# Altium schematic sheet rtc_accel.SchDoc: Opo8001
size Letter; Author: William W. Huang; Organization: Altium Limited; Address1: L3, 12a Rodborough Rd; Address2: Frenchs Forest; Address3: NSW; Address4: Australia 2086; Revision: 2
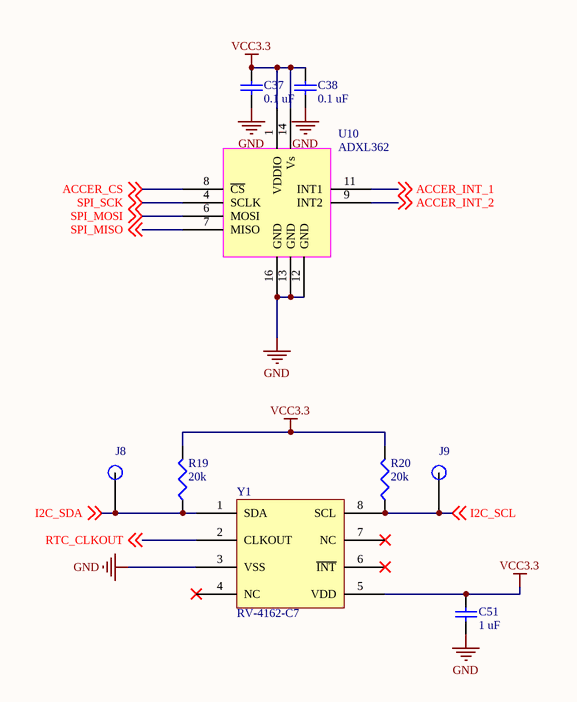
[diagram p0: rtc_accel.SchDoc]

## Parts
C37  value 0.1 uF  [0402]  (hidden comment: Ceramic capacitor)
C38  value 0.1 uF  [0402]  (hidden comment: Ceramic capacitor)
C51  value 1 uF  [0402]  (hidden comment: Ceramic capacitor)
J8  RCU 0603 SMD Testpoint  [RCU_0603]  (value not drawn)
J9  RCU 0603 SMD Testpoint  [RCU_0603]  (value not drawn)
R19  value 20k  [0402]  (hidden comment: 20k Resistor)
R20  value 20k  [0402]  (hidden comment: 20k Resistor)
U10  ADXL362  [LGA_CC-16-4]
Y1  RV-4162-C7  [RV4162]

## Nets
GND: C37.2 C38.2 C51.2 U10.12(GND) U10.13(GND) U10.16(GND) Y1.3(VSS)
VCC3.3: C37.1 C38.1 C51.1 R19.1 R20.1 U10.1(VDDIO) U10.14(Vs) Y1.5(VDD)
ACCER_CS: U10.8(~{CS}) ; off-sheet ACCER_CS
ACCER_INT_1: U10.11(INT1) ; off-sheet ACCER_INT_1
ACCER_INT_2: U10.9(INT2) ; off-sheet ACCER_INT_2
I2C_SCL: J9.1(J) R20.2 Y1.8(SCL) ; off-sheet I2C_SCL
I2C_SDA: J8.1(J) R19.2 Y1.1(SDA) ; off-sheet I2C_SDA
RTC_CLKOUT: Y1.2(CLKOUT) ; off-sheet RTC_CLKOUT
SPI_MISO: U10.7(MISO) ; off-sheet SPI_MISO
SPI_MOSI: U10.6(MOSI) ; off-sheet SPI_MOSI
SPI_SCK: U10.4(SCLK) ; off-sheet SPI_SCK

Not connected (* = marked no-connect by the designer): Y1 4(NC)* 6(~{INT})* 7(NC)*

## Notes on the sheet
- Title
- Date:
- Author:
- Revision:
- Sheet
- of
- University of Michigan
- File:

## Library data of the parts
C37 C38 = C_0.1u_0402_ceramic: Ceramic capacitor, 0.1u, 0402 package; Manufacture: TDK; voltage rated: 10 V; tolerance: 10%; Supplier 1: Digi-Key; Supplier Part Number 1: 445-1265-1-ND; package: 0402
C51 = C_1u_0402_ceramic: Ceramic capacitor, 1 uF, 0402 package; Manufacture: TDK; voltage rated: 6.3 V; tolerance: 10%; package: 0402; Supplier 1: Digi-Key; Supplier Part Number 1: 445-5000-1-ND
J8 J9 = Testpoint-0603: 0603 SMD Testpoint; Supplier 1: Digikey; Supplier Part Number 1: A106145CT-ND
R19 R20 = R_20K_0402: 20k ohm, 0402, 1%, .1W; Supplier 1: Digikey; Supplier Part Number 1: RR05P20.0KDCT-ND
U10 = ADXL362: Micropower, 3-Axis, ±2 g/±4 g/±8 g  Digital Output MEMS Accelerometer; Supplier 1: Digi-Key; Supplier Part Number 1: ADXL362BCCZ-RL7CT-ND
Y1 = RV-4162-C7: Real Time Clock Module with I2C Bus; Supplier 1: Newark; Supplier Part Number 1: 09X0517